# EAGLE schematic Sensor (EAGLE 6.2)
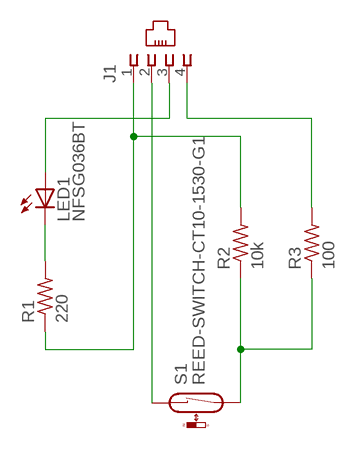
[diagram p0: schematic, sheet 1]

## Parts
J1  555166-3  [555166-3]
LED1  NFSG036BT  [NFSG036BT]
R1  220  R-US_R0603  [R0603]
R2  10k  R-US_R0603  [R0603]
R3  100  R-US_R0603  [R0603]
S1  REED-SWITCH-CT10-1530-G1  [CT10-G1]

## Nets
N$1: J1.2 S1.1
N$2: R2.1 R3.1 S1.2
N$3: J1.4 R3.2
N$4: LED1.C R1.2
N$5: J1.3 LED1.A
N$6: J1.1 R1.1 R2.2

## Library data of the parts
J1 = con-amp:555166-3: AMP connector
LED1 = led:NFSG036BT: CHIP TYPE GREEN LED NFSx036xT Source: NICHIA CORPORATION .. NFSG036BT-E.pdf
R1-R3 = resistor:R-US_: RESISTOR, American symbol
S1 = switch-reed:REED-SWITCH-: Reed Sensor; MF: COTO TECHNOLOGY; MPN: CT10-1530-G1; OC_FARNELL: 1081696